# Altium schematic sheet Power.SchDoc
size A3
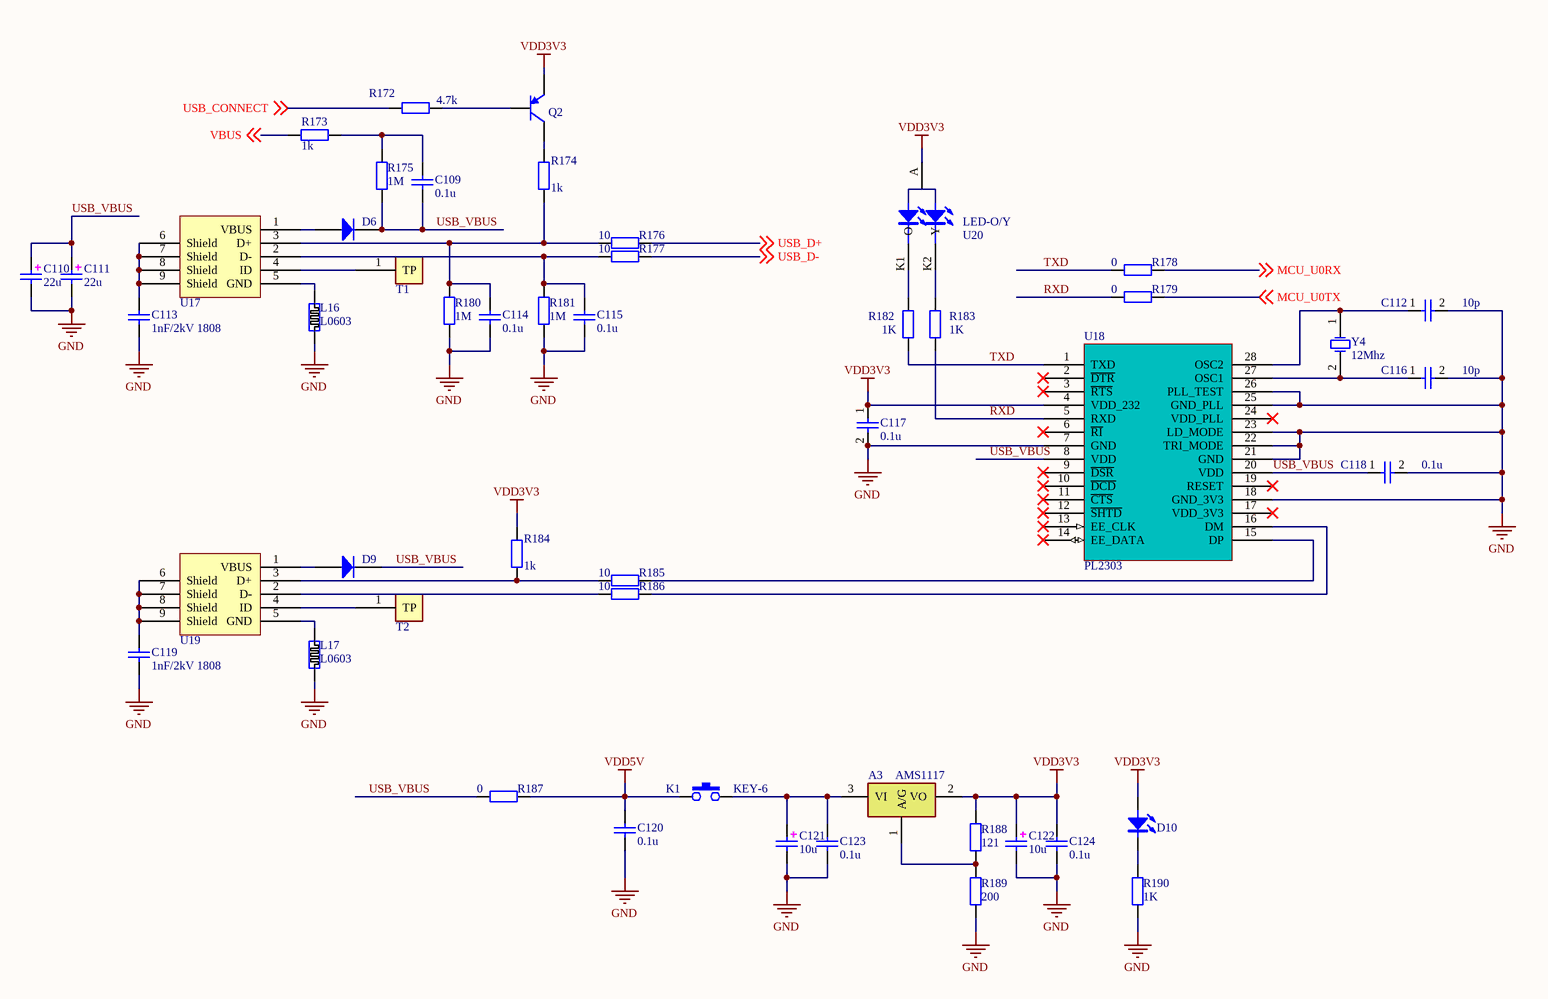
[diagram p0: Power.SchDoc]

## Parts
A3  AMS1117  [ASM1117-A]
C109  0.1u  [C0603]
C110  22u  [C1210]
C111  22u  [C1210]
C112  10p  [C0603]
C113  1nF/2kV 1808  [C1808]
C114  0.1u  [C0603]
C115  0.1u  [C0603]
C116  10p  [C0603]
C117  0.1u  [C0603]
C118  0.1u  [C0603]
C119  1nF/2kV 1808  [C1808]
C120  0.1u  [C0603]
C121  10u  [C1210]
C122  10u  [C1210]
C123  0.1u  [C0603]
C124  0.1u  [C0603]
D6  D1N_SMT  [DIODE-SMT]  (value not drawn)
D9  D1N_SMT  [DIODE-SMT]  (value not drawn)
D10  LED_SMT  [LED0805]  (value not drawn)
K1  KEY-6  [ZS-6]
L16  L0603  [L0603]
L17  L0603  [L0603]
Q2  PNP_SOT23  [T-SOT23]  (value not drawn)
R172  4.7k  [R0603]
R173  1k  [R0603]
R174  1k  [R0603]
R175  1M  [R0603]
R176  10  [R0603]
R177  10  [R0603]
R178  0  [R0603]
R179  0  [R0603]
R180  1M  [R0603]
R181  1M  [R0603]
R182  1K  [R0603]
R183  1K  [R0603]
R184  1k  [R0603]
R185  10  [R0603]
R186  10  [R0603]
R187  0  [R0603]
R188  121  [R0603]
R189  200  [R0603]
R190  1K  [R0603]
T1  TP  [TP30]  (value not drawn)
T2  TP  [TP30]  (value not drawn)
U17  USB_MINI_B  [USB_MINI_B]  (value not drawn)
U18  PL2303  [SSOP28]
U19  USB_MINI_B  [USB_MINI_B]  (value not drawn)
U20  LED-O/Y  [LED3-I26-70]
Y4  12Mhz  [XTAL-SMD-LP]

## Nets
GND: C110.2 C111.2 C112.2 C113.1 C114.2 C115.2 C116.2 C117.2 C118.2 C119.1 C120.1 C121.2 C122.2 C123.1 C124.1 L16.1 L17.1 R180.2 R181.2 R189.1 R190.2 U18.7(GND) U18.18(GND_3V3) U18.21(GND) U18.22(TRI_MODE) U18.23(LD_MODE) U18.25(GND_PLL) U18.26(PLL_TEST)
VDD3V3: A3.2(VO) C117.1 C122.1 C124.2 D10.A Q2.2(E) R184.1 R188.2 U18.4(VDD_232) U20.A
VDD5V: C120.2 K1.1 R187.2
MCU_U0RX: R178.2 ; off-sheet MCU_U0RX
MCU_U0TX: R179.2 ; off-sheet MCU_U0TX
RXD: R179.1 R183.2 U18.5(RXD)
TXD: R178.1 R182.2 U18.1(TXD)
USB_CONNECT: R172.2 ; off-sheet USB_CONNECT
USB_D+: R176.2 ; off-sheet USB_D+
USB_D-: R177.2 ; off-sheet USB_D-
USB_VBUS: C109.2 C110.1 C111.1 C118.1 D6.2 D9.2 R175.2 R187.1 U18.8(VDD) U18.20(VDD)
VBUS: R173.1 ; off-sheet VBUS
NetA3_1: A3.1(A/G) R188.1 R189.2
NetA3_3: A3.3(VI) C121.1 C123.2 K1.2
NetC109_1: C109.1 R173.2 R175.1
NetC112_1: C112.1 U18.28(OSC2) Y4.1(OSC1)
NetC113_2: C113.2 U17.6(Shield) U17.7(Shield) U17.8(Shield) U17.9(Shield)
NetC114_1: C114.1 R174.2 R176.1 R180.1 U17.3(D+)
NetC115_1: C115.1 R177.1 R181.1 U17.2(D-)
NetC116_1: C116.1 U18.27(OSC1) Y4.2(OSC2)
NetC119_2: C119.2 U19.6(Shield) U19.7(Shield) U19.8(Shield) U19.9(Shield)
NetD6_1: D6.1 U17.1(VBUS)
NetD9_1: D9.1 U19.1(VBUS)
NetD10_K: D10.K R190.1
NetL16_2: L16.2 U17.5(GND)
NetL17_2: L17.2 U19.5(GND)
NetQ2_1: Q2.1(B) R172.1
NetQ2_3: Q2.3(C) R174.1
NetR182_1: R182.1 U20.K1(O)
NetR183_1: R183.1 U20.K2(Y)
NetR184_2: R184.2 R185.1 U19.3(D+)
NetR185_2: R185.2 U18.15(DP)
NetR186_1: R186.1 U19.2(D-)
NetR186_2: R186.2 U18.16(DM)
NetT1_1: T1.1(TP) U17.4(ID)
NetT2_1: T2.1(TP) U19.4(ID)

Not connected (* = marked no-connect by the designer): U18 2(~{DTR})* 3(~{RTS})* 6(~{RI})* 9(~{DSR})* 10(~{DCD})* 11(~{CTS})* 12(~{SHTD})* 13(EE_CLK)* 14(EE_DATA)* 17(VDD_3V3)* 19(RESET)* 24(VDD_PLL)*

## Library data of the parts
A3 = AMS1117: 1117 LDO
C109 C113-C115 C119 C120 C123 C124 = CAP0603: 0603 Capacitor without Polarity
C110 C111 C121 C122 = DCAP: 钽电容1210封装
C112 C116-C118 = cap0603
D6 D9 = DIODE_SMT: 贴片二极管
D10 = LED_SMT: 贴片发光二极管
K1 = KEY-6: 自锁开关
L16 L17 = L0603: 0603 Inductor
Q2 = PNP_SOT23: PNP贴片封装,eg S8550
R172-R175 R180 R181 R184 R188 R189 = RES0603: 0603 Resistor
R176-R179 R185-R187 = RES0805: 0805 Resistor
R182 R183 R190 = R06003
T1 T2 = TP: Test Point
U17 U19 = USB_MINI_B: mini USB
Y4 = XTAL: 2Pin晶振